# Altium project gemschematic_Chris_edits.PrjPcb
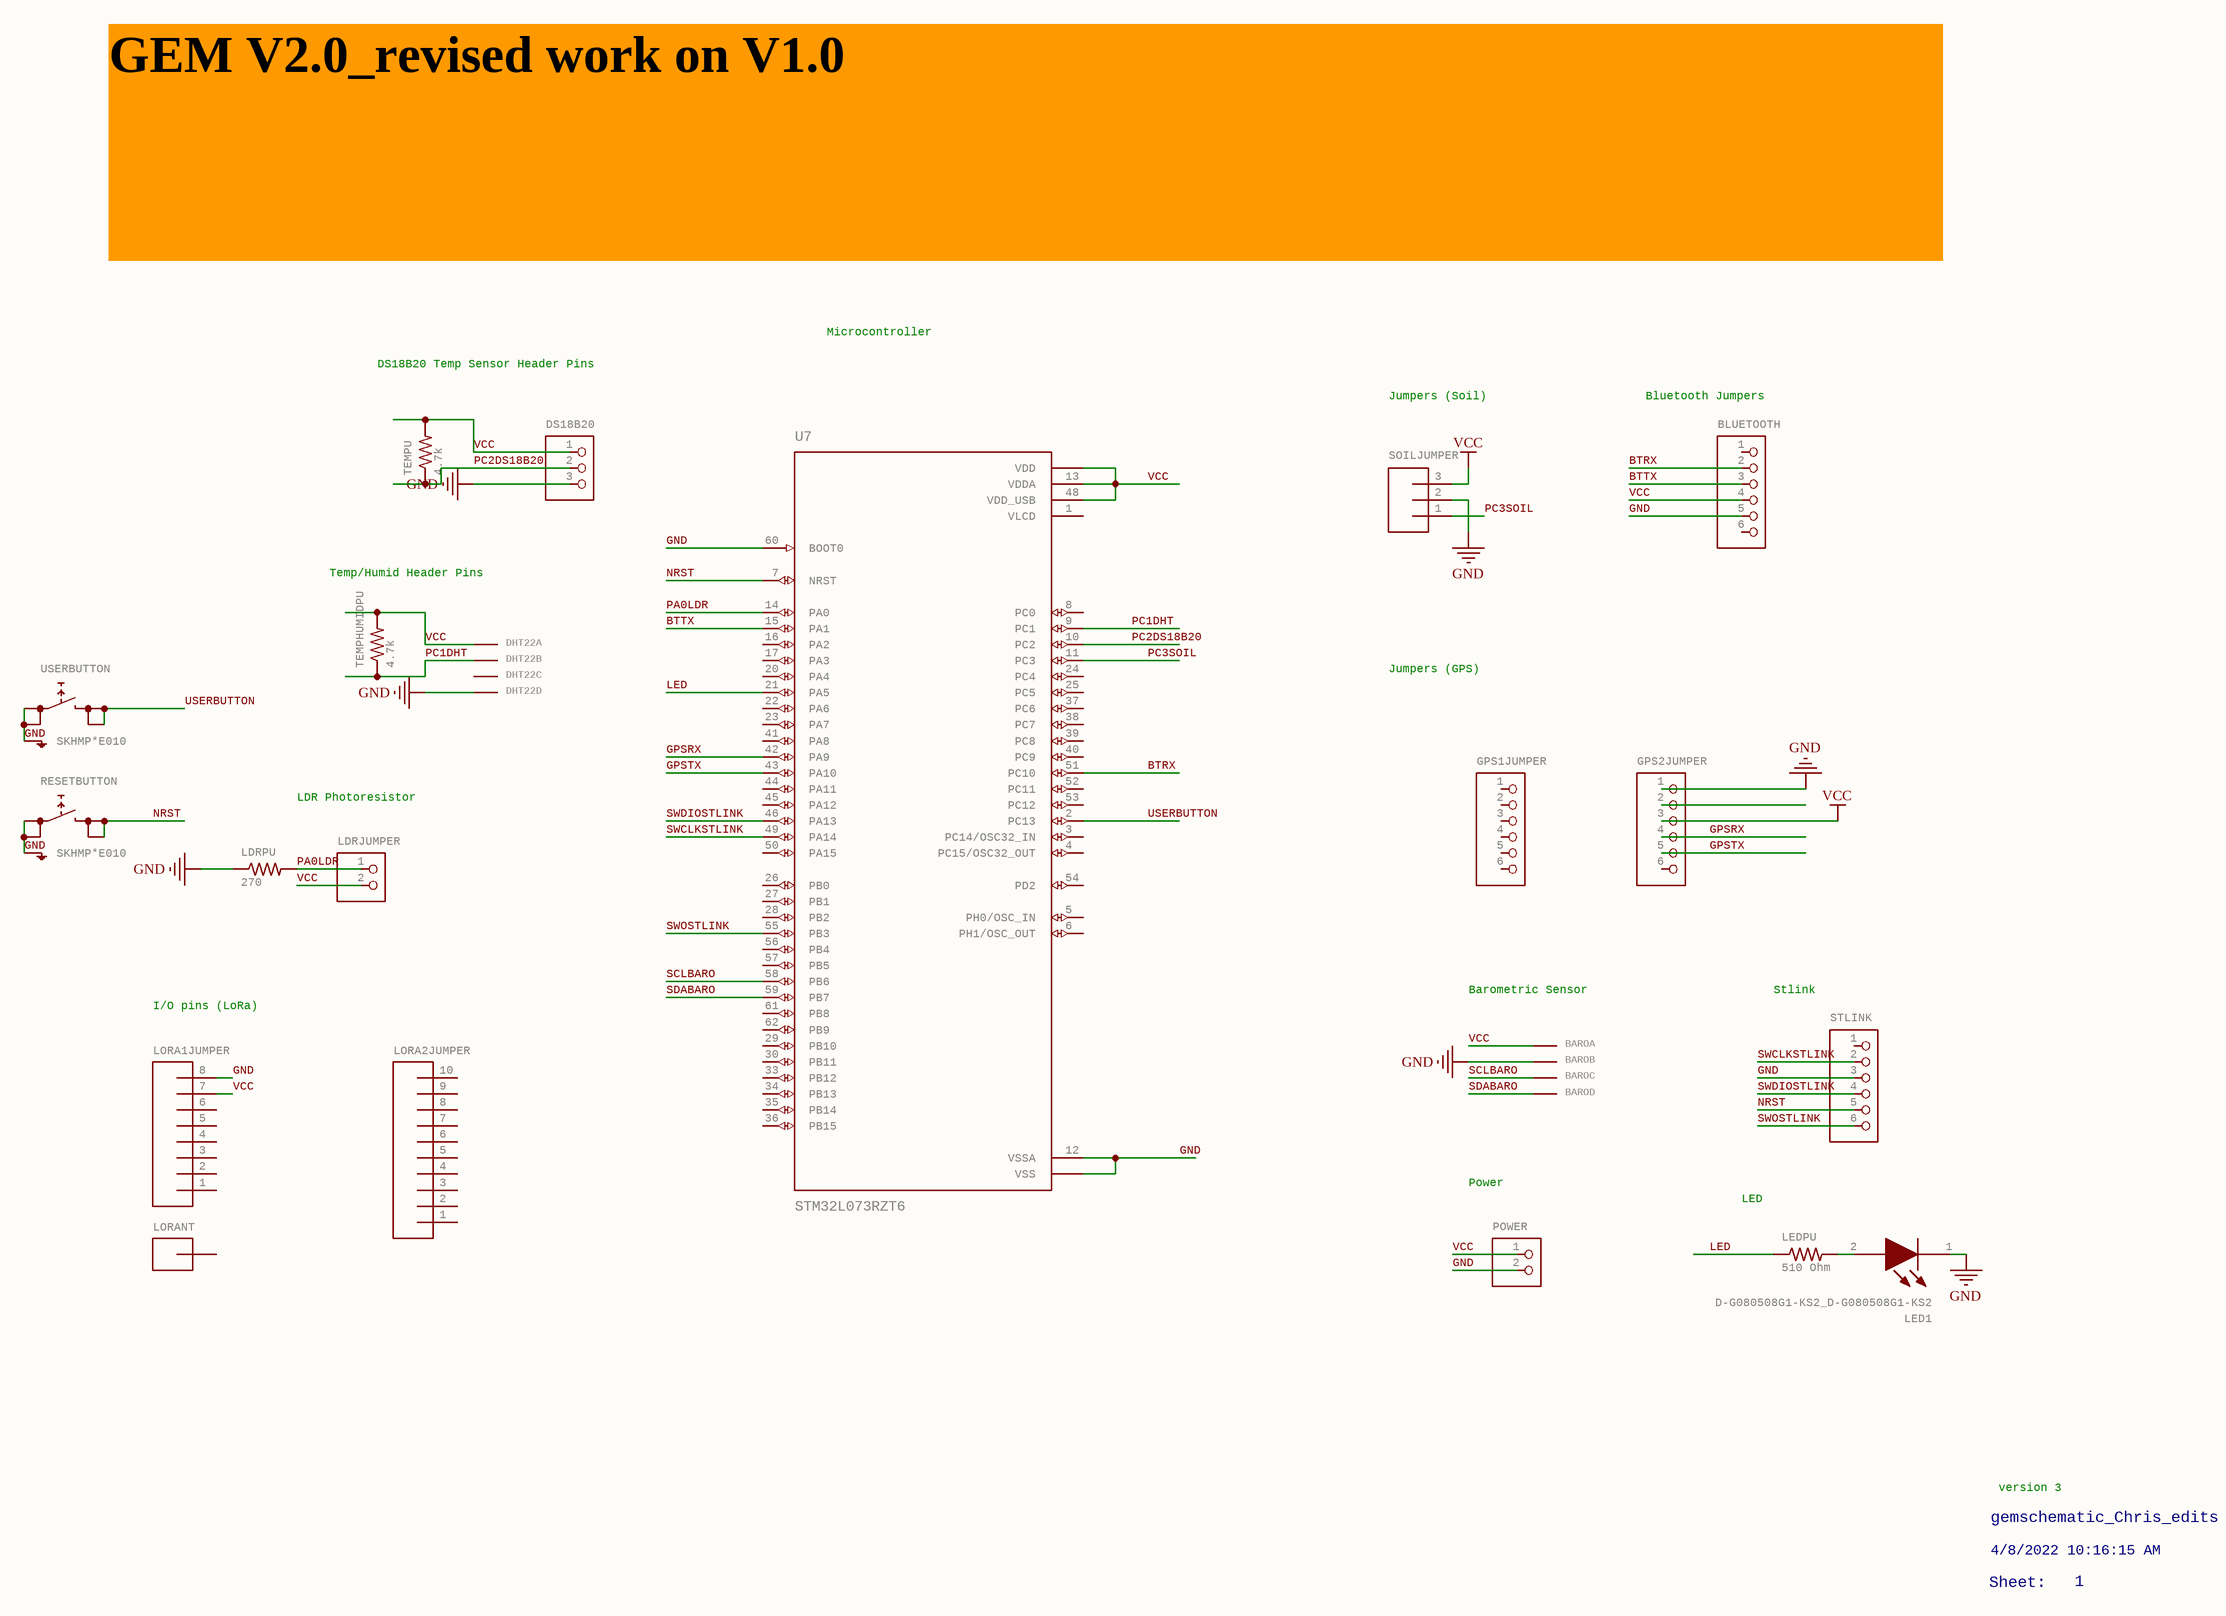
[diagram p0: gemschematic_Chris_edits.SchDoc]
1 sheet, 21 parts. Net scope: global (net labels, ports and power ports of the same name join across sheets).
Board file: gemschematic_Chris_edits.PcbDoc

## Sheet gemschematic_Chris_edits.SchDoc: gemschematic_Chris_edits
size 409 x 289 mm; Date: 4/8/2022 10:16:15 AM; SheetNumber: 1; Origin: Eagle; GateName_1: G$1; SymbolName_1: A3L-LOC; LibraryName: frames; DeviceSetName: A3L-LOC; Sheet: Sheet:

### Parts
BARO  22-23-2041  [22-23-2041]  (value not drawn)  (parts A,B,C,D of 4)
BLUETOOTH  PINHD-1X6  [1X06]  (value not drawn)
DHT22  22-23-2041  [22-23-2041]  (value not drawn)  (parts A,B,C,D of 4)
DS18B20  PINHD-1X3  [1X03]  (value not drawn)
GPS1JUMPER  HEADER-1X670MIL  [1X06_ROUND_70]  (value not drawn)
GPS2JUMPER  HEADER-1X670MIL  [1X06_ROUND_70]  (value not drawn)
LDRJUMPER  PINHD-1X2  [1X02]  (value not drawn)
LDRPU  270  [M0805]
LED1  D-G080508G1-KS2_D-G080508G1-KS2  [D-G080508G1-KS2_LEDC2012X85N]
LEDPU  510 Ohm  [M0805]
LORA1JUMPER  CONN_08NO_SILK_FEMALE_PTH  [1X08_NO_SILK]  (value not drawn)
LORA2JUMPER  CONN_10NO_SILK_PTH_FEMALE  [1X10_NO_SILK]  (value not drawn)
LORANT  CONN_01PTH_NO_SILK_YES_STOP  [1X01_NO_SILK]  (value not drawn)
POWER  PINHD-1X2  [1X02]  (value not drawn)
RESETBUTTON  SKHMP*E010  [SKHMPXE010]
SOILJUMPER  M03SCREW_LOCK  [SCREWTERMINAL-3.5MM-3_LOCK.007S]  (value not drawn)
STLINK  PINHD-1X6  [1X06]  (value not drawn)
TEMPHUMIDPU  4.7k  [M0805]
TEMPU  4.7k  [M0805]
U7  STM32L073RZT6  [QFP50P1200X1200X160-64N]
USERBUTTON  SKHMP*E010  [SKHMPXE010]

### Nets
GND: BARO.2(S) BLUETOOTH.5 DHT22.4(S) DS18B20.3 GPS2JUMPER.1 LDRPU.1 LED1.1(K) LORA1JUMPER.8 POWER.2 RESETBUTTON.1(1.1) RESETBUTTON.2(1.2) RESETBUTTON.5(SH) SOILJUMPER.2 STLINK.3 U7.12(VSSA) U7.18_31_47_63(VSS) U7.60(BOOT0) USERBUTTON.1(1.1) USERBUTTON.2(1.2) USERBUTTON.5(SH)
VCC: BARO.1(S) BLUETOOTH.4 DHT22.1(S) DS18B20.1 GPS2JUMPER.3 LDRJUMPER.2 LORA1JUMPER.7 POWER.1 SOILJUMPER.3 TEMPHUMIDPU.2 TEMPU.2 U7.13(VDDA) U7.19_32_64(VDD) U7.48(VDD_USB)
BTRX: BLUETOOTH.2 U7.51(PC10)
BTTX: BLUETOOTH.3 U7.15(PA1)
GPSRX: GPS2JUMPER.4 U7.42(PA9)
GPSTX: GPS2JUMPER.5 U7.43(PA10)
LED: LEDPU.1 U7.21(PA5)
NRST: RESETBUTTON.3(2.1) RESETBUTTON.4(2.2) STLINK.5 U7.7(NRST)
PA0LDR: LDRJUMPER.1 LDRPU.2 U7.14(PA0)
PC1DHT: DHT22.2(S) TEMPHUMIDPU.1 U7.9(PC1)
PC2DS18B20: DS18B20.2 TEMPU.1 U7.10(PC2)
PC3SOIL: SOILJUMPER.1 U7.11(PC3)
SCLBARO: BARO.3(S) U7.58(PB6)
SDABARO: BARO.4(S) U7.59(PB7)
SWCLKSTLINK: STLINK.2 U7.49(PA14)
SWDIOSTLINK: STLINK.4 U7.46(PA13)
SWOSTLINK: STLINK.6 U7.55(PB3)
USERBUTTON: U7.2(PC13) USERBUTTON.3(2.1) USERBUTTON.4(2.2)
NetLED1_2: LED1.2(A) LEDPU.2

Not connected (* = marked no-connect by the designer): BLUETOOTH 1 6; DHT22 3(S); GPS1JUMPER 1 2 3 4 5 6; GPS2JUMPER 2 6; LORA1JUMPER 1 2 3 4 5 6; LORA2JUMPER 1 2 3 4 5 6 7 8 9 10; LORANT 1; STLINK 1; U7 1(VLCD) 3(PC14/OSC32_IN) 4(PC15/OSC32_OUT) 5(PH0/OSC_IN) 6(PH1/OSC_OUT) 8(PC0) 16(PA2) 17(PA3) 20(PA4) 22(PA6) 23(PA7) 24(PC4) 25(PC5) 26(PB0) 27(PB1) 28(PB2) 29(PB10) 30(PB11) 33(PB12) 34(PB13) 35(PB14) 36(PB15) 37(PC6) 38(PC7) 39(PC8) 40(PC9) 41(PA8) 44(PA11) 45(PA12) 50(PA15) 52(PC11) 53(PC12) 54(PD2) 56(PB4) 57(PB5) 61(PB8) 62(PB9)

### Notes on the sheet
- GEM V2.0_revised work on V1.0
- Microcontroller
- DS18B20 Temp Sensor Header Pins
- Jumpers (Soil)
- (near BLUETOOTH) Bluetooth Jumpers
- Temp/Humid Header Pins
- Jumpers (GPS)
- LDR Photoresistor
- I/O pins (LoRa)
- (near BARO) Barometric Sensor
- Stlink
- Power
- (near LEDPU) LED
- gemschematic_Chris_edits
- version 3
- Sheet:
- 4/8/2022 10:16:15 AM
- 1

### Library data of the parts
BARO DHT22 = 22-23-2041: .100" (2.54mm) Center Header - 4 Pin; GateName_1: -1; SymbolName_1: MV; GateName_2: -2; SymbolName_2: M; GateName_3: -3; GateName_4: -4; MF: MOLEX; POPULARITY: 21; SymbolName_3: M; SymbolName_4: M; LibraryName: con-molex; DeviceSetName: 22-23-2041; MPN: 22-23-2041; OC_FARNELL: 1462920; OC_NEWARK: 38C0355
BLUETOOTH STLINK = PINHD-1X6: PIN HEADER; GateName_1: A; SymbolName_1: PINHD6; LibraryName: adafruit; DeviceSetName: PINHD-1X6
DS18B20 = PINHD-1X3: PIN HEADER; GateName_1: A; SymbolName_1: PINHD3; LibraryName: adafruit; DeviceSetName: PINHD-1X3
GPS1JUMPER GPS2JUMPER = HEADER-1X670MIL: PIN HEADER; GateName_1: A; SymbolName_1: PINHD6; DeviceName: 70MIL; LibraryName: microbuilder; DeviceSetName: HEADER-1X6
LDRJUMPER POWER = PINHD-1X2: PIN HEADER; GateName_1: G$1; SymbolName_1: PINHD2; POPULARITY: 98; LibraryName: pinhead; DeviceSetName: PINHD-1X2
LDRPU LEDPU TEMPHUMIDPU TEMPU = R-US_M0805: RESISTOR, American symbol; GateName_1: G$1; SymbolName_1: R-US; DeviceSetName: R-US_; DeviceName: M0805; LibraryName: adafruit
LED1 = D-G080508G1-KS2_D-G080508G1-KS2: Light Emitting Diodes (LED) Green 526~531nm 250~330mcd@5mA Top View 0805 RoHS   Source:  Datasheet; MANUFACTURER_NAME: Wuxi ARK Tech Elec; GateName_1: G$1; SymbolName_1: D-G080508G1-KS2_D-G080508G1-KS2; LibraryName: ce-capstone-2022; DeviceSetName: D-G080508G1-KS2_D-G080508G1-KS2; ARROW_PART_NUMBER: ARROW_PART_NUMBER; ARROW_PRICE-STOCK: ARROW_PRICE-STOCK; HEIGHT: 0.85mm; MANUFACTURER_PART_NUMBER: D-G080508G1-KS2; MOUSER_PART_NUMBER: MOUSER_PART_NUMBER; MOUSER_PRICE-STOCK: MOUSER_PRICE-STOCK
LORA1JUMPER = CONN_08NO_SILK_FEMALE_PTH: Multi connection point. Often used as Generic Header-pin footprint for 0.1 inch spaced/style header connections    On any of the 0.1 inch spaced packages, you can populate with these:  Break Away Headers - Straight (PRT-00116)   Break Away Male Headers - Right Angle (PRT-00553)   Female Headers (PRT-00115)   Break Away Headers - Machine Pin (PRT-00117)   Break Away Female Headers - Swiss Machine Pin (PRT-00743)   Arduino Stackable Header - 8 Pin (PRT-09279)        For SCREWTERMINALS and SPRING TERMINALS visit here:  Screw Terimnals on SparkFun.com (5mm/3.5mm/2.54mm spacing)       This device is also useful as a general connection point to wire up your design to another part of your project. Our various solder wires solder well into these plated through hole pads.  Hook-Up Wire - Assortment (Stranded, 22 AWG) (PRT-11375)   Hook-Up Wire - Assortment (Solid Core, 22 AWG) (PRT-11367)   View the entire wire category on our website here          Special notes:     Molex polarized connector foot print use with SKU : PRT-08231 with associated crimp pins and housings. 1MM SMD Version SKU: PRT-10208    NOTES ON THE VARIANTS LOCK and LOCK_LONGPADS... This footprint was designed to help hold the alignment of a through-hole component (i.e.  6-pin header) while soldering it into place. You may notice that each hole has been shifted either up or down by 0.005 of an inch from it's more standard position (which is a perfectly straight line).  This slight alteration caused the pins (the squares in the middle) to touch the edges of the holes.  Because they are alternating, it causes a "brace" to hold the component in place.  0.005 has proven to be the perfect amount of "off-center" position when using our standard breakaway headers. Although looks a little odd when you look at the bare footprint, once you have a header in there, the alteration is very hard to notice.  Also,if you push a header all the way into place, it is covered up entirely on the bottom side.; GateName_1: G$1; PROD_ID: CONN-08438; SymbolName_1: CONN_08; DeviceName: NO_SILK_FEMALE_PTH; LibraryName: SparkFun-Connectors; DeviceSetName: CONN_08
LORA2JUMPER = CONN_10NO_SILK_PTH_FEMALE: Multi connection point. Often used as Generic Header-pin footprint for 0.1 inch spaced/style header connections    On any of the 0.1 inch spaced packages, you can populate with these:  Break Away Headers - Straight (PRT-00116)   Break Away Male Headers - Right Angle (PRT-00553)   Female Headers (PRT-00115)   Break Away Headers - Machine Pin (PRT-00117)   Break Away Female Headers - Swiss Machine Pin (PRT-00743)   Arduino Stackable Header - 10 Pin (PRT-11376)        For SCREWTERMINALS and SPRING TERMINALS visit here:  Screw Terimnals on SparkFun.com (5mm/3.5mm/2.54mm spacing)       This device is also useful as a general connection point to wire up your design to another part of your project. Our various solder wires solder well into these plated through hole pads.  Hook-Up Wire - Assortment (Stranded, 22 AWG) (PRT-11375)   Hook-Up Wire - Assortment (Solid Core, 22 AWG) (PRT-11367)   View the entire wire category on our website here          Special notes:     Molex polarized connector foot print use with SKU : PRT-08231 with associated crimp pins and housings. 1MM SMD Version SKU: PRT-10208    NOTES ON THE VARIANTS LOCK and LOCK_LONGPADS... This footprint was designed to help hold the alignment of a through-hole component (i.e.  6-pin header) while soldering it into place. You may notice that each hole has been shifted either up or down by 0.005 of an inch from it's more standard position (which is a perfectly straight line).  This slight alteration caused the pins (the squares in the middle) to touch the edges of the holes.  Because they are alternating, it causes a "brace" to hold the component in place.  0.005 has proven to be the perfect amount of "off-center" position when using our standard breakaway headers. Although looks a little odd when you look at the bare footprint, once you have a header in there, the alteration is very hard to notice.  Also,if you push a header all the way into place, it is covered up entirely on the bottom side.; GateName_1: G$1; PROD_ID: CONN-11563; SymbolName_1: CONN_10; DeviceName: NO_SILK_PTH_FEMALE; LibraryName: SparkFun-Connectors; DeviceSetName: CONN_10
LORANT = CONN_01PTH_NO_SILK_YES_STOP: Single connection point. Often used as Generic Header-pin footprint for 0.1 inch spaced/style header connections       On any of the 0.1 inch spaced packages, you can populate with these:   Break Away Headers - Straight (PRT-00116)   Break Away Male Headers - Right Angle (PRT-00553)   Female Headers (PRT-00115)   Break Away Headers - Machine Pin (PRT-00117)   Break Away Female Headers - Swiss Machine Pin (PRT-00743)          This device is also useful as a general connection point to wire up your design to another part of your project. Our various solder wires solder well into these plated through hole pads.   Hook-Up Wire - Assortment (Stranded, 22 AWG) (PRT-11375)   Hook-Up Wire - Assortment (Solid Core, 22 AWG) (PRT-11367)   View the entire wire category on our website here          Special notes:    SMTSO-256-ET is a "flush mount" nut for a 4-40 screw. We mostly use this on specialty testbeds; it is a nice way to connect hardware to your PCB at an adjustable hieght.    Also note, the SNAP packages are for using a snappable style connector. We sell a baggie of snaps and they are also used on two LilyPad designs:   Snap Assortment - 30 pack (male and female) (DEV-11347)  LilyPad Arduino SimpleSnap (DEV-10941)   LilyPad SimpleSnap Protoboard (DEV-10940); GateName_1: G$1; SymbolName_1: CONN_01; DeviceName: PTH_NO_SILK_YES_STOP; LibraryName: SparkFun-Connectors; DeviceSetName: CONN_01
RESETBUTTON USERBUTTON = SKHMP*E010: 6.2 X 6.5mm TACT Switch (SMD)   Source: http://www3.alps.co.jp/WebObjects/catalog.woa/PDF/E/Switch/Tact/SKHM/SKHM.PDF; GateName_1: G$1; SymbolName_1: NORMOPEN_SHIELD; POPULARITY: 5; LibraryName: switch; DeviceSetName: SKHMP*E010
SOILJUMPER = M03SCREW_LOCK: Header 3Standard 3-pin 0.1" header. Use with straight break away headers (SKU : PRT-00116), right angle break away headers (PRT-00553), swiss pins (PRT-00743), machine pins (PRT-00117), and female headers (PRT-00115). Molex polarized connector foot print use with SKU : PRT-08232 with associated crimp pins and housings.; GateName_1: G$1; SymbolName_1: M03; PROD_ID: CONN-08288; DeviceName: SCREW_LOCK; LibraryName: SparkFun-Connectors; DeviceSetName: M03
U7 = STM32L073RZT6: None Check availability; GateName_1: G$1; MF: STMicroelectronics; SymbolName_1: STM32L073RZT6; LibraryName: STM32L073RZT6; DeviceSetName: STM32L073RZT6; AVAILABILITY: In Stock; MP: STM32L073RZT6; PACKAGE: LQFP-64 STMicroelectronics; PRICE: None; PURCHASE-URL: https://pricing.snapeda.com/search/part/STM32L073RZT6/?ref=eda